# EasyEDA Pro project ProPrj_KrabbyUno - v0.2_2026-05-19.epro, schematic Schematic1

## Sheets
1 P1: Board Name: Board1; Create Date: 2026-01-30; Page Name: P1; Project Name: Patina Foundation Grant; Schematic Name: Schematic1; Update Date: 2026-04-27
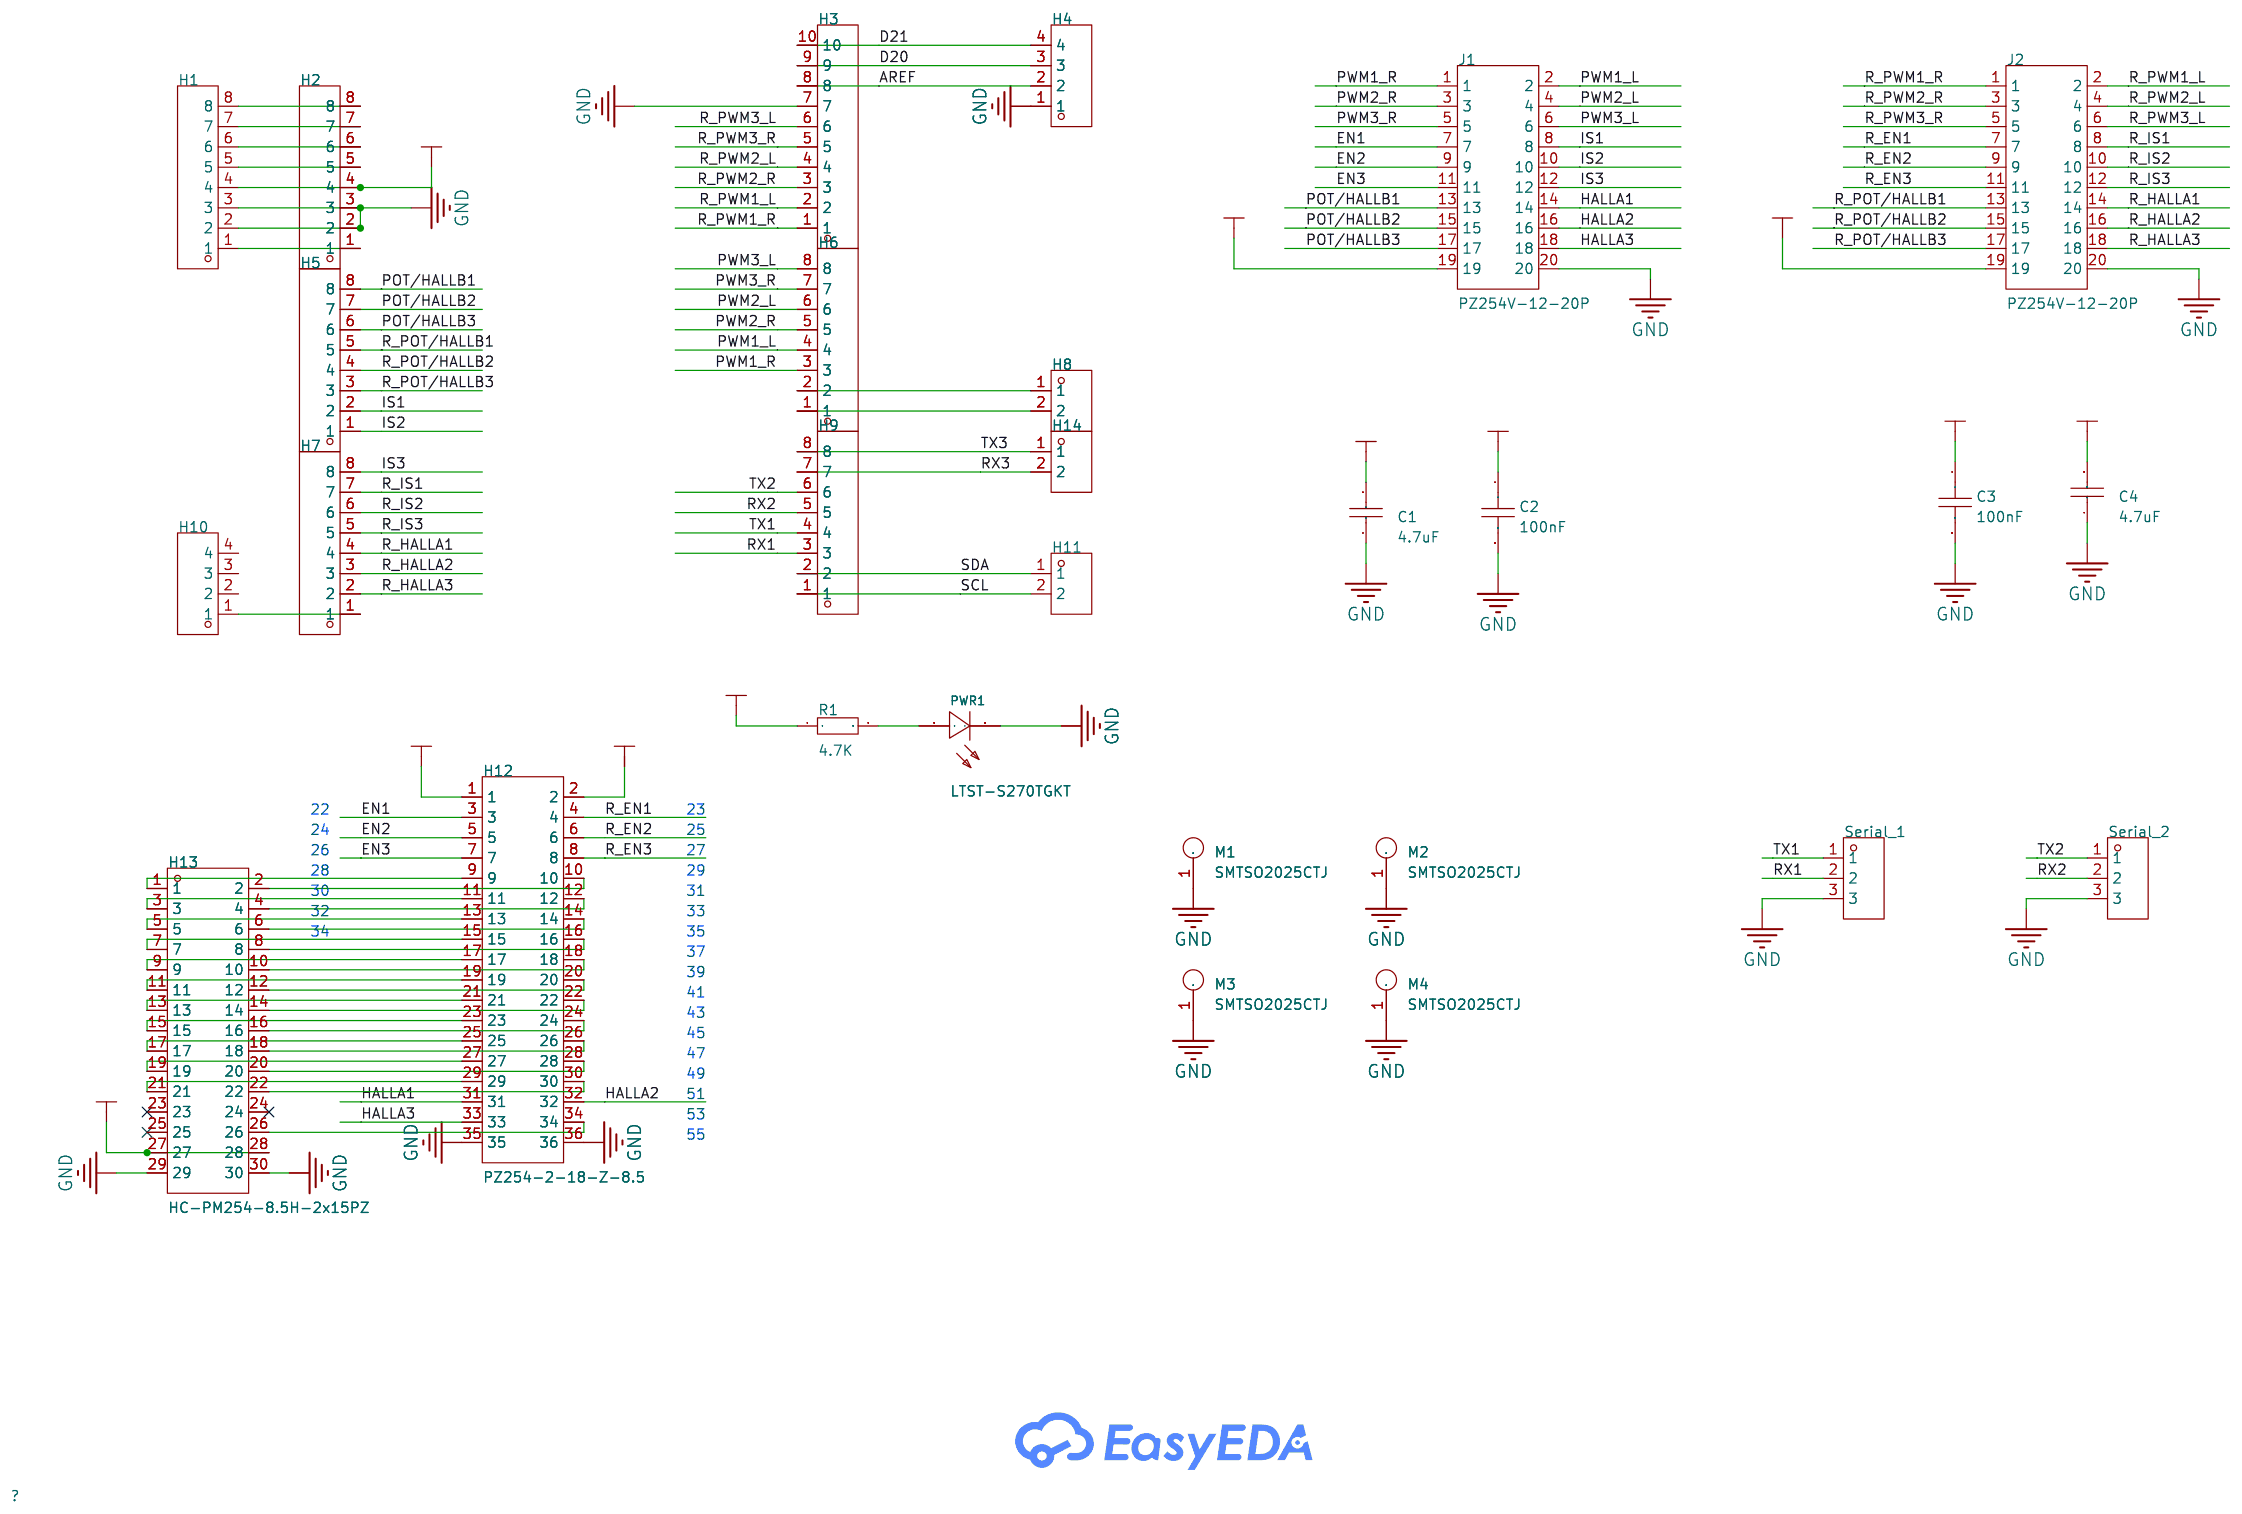
[diagram p0: P1]
2 P2: Create Date: 2026-02-06; Page Name: P2; Update Date: 2026-02-14; Company: EasyEDA.com; Page Size: A4; Version: V1.0
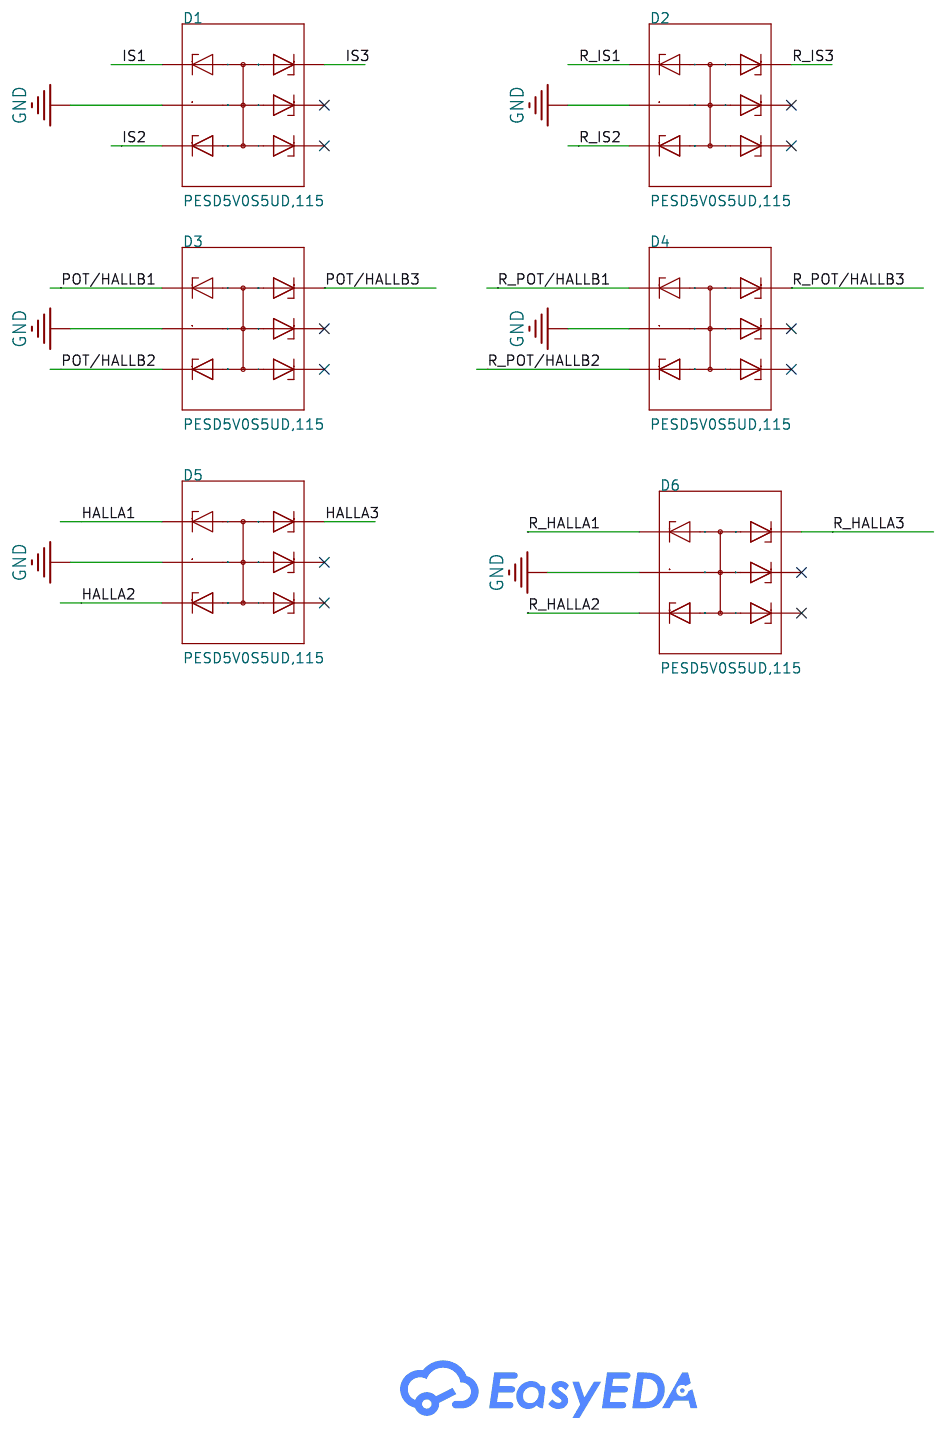
[diagram p1: P2]

## Parts
sheet P1
C1  4.7uF  [C0805]
C2  100nF  [C0603]
C3  100nF  [C0603]
C4  4.7uF  [C0805]
H1  PM254-1-08-Z-8.5  [HDR-TH_8P-P2.54-V-F]
H2  PZ254V-11-08P  [HDR-TH_8P-P2.54-V-M]
H3  PZ254V-11-10P  [HDR-TH_10P-P2.54-V-M]
H4  PM254-1-04-Z-8.5  [HDR-TH_4P-P2.54-V-F]
H5  PZ254V-11-08P  [HDR-TH_8P-P2.54-V-M]
H6  PZ254V-11-08P  [HDR-TH_8P-P2.54-V-M]
H7  PZ254V-11-08P  [HDR-TH_8P-P2.54-V-M]
H8  PM254-1-02-Z-8.5  [HDR-TH_2P-P2.54-V-F]
H9  PZ254V-11-08P  [HDR-TH_8P-P2.54-V-M]
H10  PM254-1-04-Z-8.5  [HDR-TH_4P-P2.54-V-F]
H11  PM254-1-02-Z-8.5  [HDR-TH_2P-P2.54-V-F]
H12  PZ254-2-18-Z-8.5  [HDR-TH_36P-P2.54-V-M-R2-C18-S2.54]
H13  HC-PM254-8.5H-2x15PZ  [HDR-TH_30P-P2.54-V-F-R2-C15-S2.54]
H14  PM254-1-02-Z-8.5  [HDR-TH_2P-P2.54-V-F]
J1  PZ254V-12-20P  [HDR-TH_20P-P2.54-V-M-R2-C10-S2.54]
J2  PZ254V-12-20P  [HDR-TH_20P-P2.54-V-M-R2-C10-S2.54]
M1  SMTSO2025CTJ  [SMD-1_BD6.2-D3.6]  (no BOM)
M2  SMTSO2025CTJ  [SMD-1_BD6.2-D3.6]  (no BOM)
M3  SMTSO2025CTJ  [SMD-1_BD6.2-D3.6]  (no BOM)
M4  SMTSO2025CTJ  [SMD-1_BD6.2-D3.6]  (no BOM)
PWR1  LTST-S270TGKT  [LED-SMD_L1.7-W0.6-RD_GREEN]
R1  4.7K  [R0603]
Serial_1  S03B-XASK-1(LF)(SN)  [CONN-TH_S03B-XASK-1]
Serial_2  S03B-XASK-1(LF)(SN)  [CONN-TH_S03B-XASK-1]
sheet P2
D1  PESD5V0S5UD,115  [SC-74-6_L3.0-W1.5-P0.95-LS2.8-BL]
D2  PESD5V0S5UD,115  [SC-74-6_L3.0-W1.5-P0.95-LS2.8-BL]
D3  PESD5V0S5UD,115  [SC-74-6_L3.0-W1.5-P0.95-LS2.8-BL]
D4  PESD5V0S5UD,115  [SC-74-6_L3.0-W1.5-P0.95-LS2.8-BL]
D5  PESD5V0S5UD,115  [SC-74-6_L3.0-W1.5-P0.95-LS2.8-BL]
D6  PESD5V0S5UD,115  [SC-74-6_L3.0-W1.5-P0.95-LS2.8-BL]

## Library data of the parts
C1 C4 = CL21A475KBQNNNE: Capacitance:4.7uF Tolerance:±10% Tolerance:±10% Voltage Rating:50V Temperature Coefficient:X5R; LCSC Part Name: 4.7uF ±10% 50V; Supplier Part: C98192; Manufacturer: SAMSUNG(三星); Supplier Footprint: 0805; JLCPCB Part Class: Extended Part; Datasheet: https://item.szlcsc.com/datasheet/CL21A475KBQNNNE/99401.html; Supplier: LCSC; Tolerance: ±10%; Voltage Rating: 50V; Temperature Coefficient: X5R
C2 C3 = CAP_0603: Supplier Footprint: 0603
H1 = PM254-1-08-Z-8.5: Holes Structure:1x8P Pitch:2.54mm Row Spacing:- Circular Hole / Square Hole:Square Hole Mounting Type:Through Hole Number of Rows:1 Number of Positions:8P Current Rating:3A Voltage Rating (Max):- Holes Direction:Top Insulation Height:8.5mm Contact Materia; LCSC Part Name: 1x8P 间距:2.54mm 直插; Supplier Part: C2897371; Manufacturer: HCTL(华灿天禄); Supplier Footprint: 插件,P=2.54mm; JLCPCB Part Class: Extended Part; Datasheet: https://item.szlcsc.com/datasheet/PM254-1-08-Z-8.5/3142376.html; Supplier: LCSC; Holes Structure: 1x8P; Pitch: 2.54mm; Circular Hole / Square Hole: Square Hole; Mounting Type: Through Hole; Number of Rows: 1; Number of Positions: 8P; Current Rating: 3A; Holes Direction: Top; Insulation Height: 8.5mm; Contact Material: Copper Alloy; Operating Temperature: -40℃~+105℃
H2 H5-H7 H9 = PZ254V-11-08P: Pin Structure:1x8P Pitch:2.54mm Row Spacing:- Circluar Pins/Square Pins:Pin Header Mounting Type:Through Hole Number of Rows:1 Number of Pins:8P Current Rating:- Voltage Rating (Max):- Length of Mating Pin:6mm Insulation Height:2.5mm Length of End Connect; LCSC Part Name: 1x8P 间距:2.54mm 方针 直插; Supplier Part: C492407; Manufacturer: XFCN(兴飞); Supplier Footprint: 插件,P=2.54mm; JLCPCB Part Class: Extended Part; Datasheet: https://item.szlcsc.com/datasheet/PZ254V-11-08P/502963.html; Supplier: LCSC; Pin Structure: 1x8P; Pitch: 2.54mm; Circluar Pins/Square Pins: Pin Header; Mounting Type: Through Hole; Number of Rows: 1; Number of Pins: 8P; Length of Mating Pin: 6mm; Insulation Height: 2.5mm; Length of End Connection Pin: 3mm; Contact Material: Brass; Operating Temperature: -40℃~+105℃; Color: Black
H3 = PZ254V-11-10P: Pin Structure:1x10P Pitch:2.54mm Row Spacing:- Circluar Pins/Square Pins:Policy Mounting Type:Straight Number of Rows:Single Row Number of Pins:10P Current Rating:- Voltage Rating (Max):- Length of Mating Pin:6mm Insulation Height:2.5mm Length of End Conn; LCSC Part Name: 1x10P 间距:2.54mm 方针 直插; Supplier Part: C492409; Manufacturer: XFCN(兴飞); Supplier Footprint: 插件,P=2.54mm; JLCPCB Part Class: Extended Part; Datasheet: https://atta.szlcsc.com/upload/public/pdf/source/20200309/C492409_129C9431BDD62EBBBD0A643B6AAB9FBD.pdf; Supplier: LCSC; Pin Structure: 1x10P; Pitch: 2.54mm; Circluar Pins/Square Pins: Policy; Mounting Type: Straight; Number of Rows: Single Row; Number of Pins: 10P; Length of Mating Pin: 6mm; Insulation Height: 2.5mm; Length of End Connection Pin: 3mm; Contact Material: Brass; Operating Temperature: -40℃~+105℃; Color: Black
H4 H10 = PM254-1-04-Z-8.5: Holes Structure:1x4P Pitch:2.54mm Row Spacing:- Circular Hole / Square Hole:Square Hole Mounting Type:Through Hole Number of Rows:1 Number of Positions:4P Current Rating:3A Holes Direction:Top Insulation Height:8.5mm Contact Material:Copper Alloy Operatin; LCSC Part Name: 1x4P 间距:2.54mm 直插; Supplier Part: C3012026; Manufacturer: HCTL(华灿天禄); Supplier Footprint: 插件,P=2.54mm; JLCPCB Part Class: Extended Part; Datasheet: https://item.szlcsc.com/datasheet/PM254-1-04-Z-8.5/3516547.html; Supplier: LCSC; Holes Structure: 1x4P; Pitch: 2.54mm; Circular Hole / Square Hole: Square Hole; Mounting Type: Through Hole; Number of Rows: 1; Number of Positions: 4P; Current Rating: 3A; Holes Direction: Top; Insulation Height: 8.5mm; Contact Material: Copper Alloy; Operating Temperature: -40℃~+105℃
H8 H11 H14 = PM254-1-02-Z-8.5: Holes Structure:1x2P Pitch:2.54mm Row Spacing:- Circular Hole / Square Hole:Square Hole Mounting Type:Through Hole Number of Rows:1 Number of Positions:2P Current Rating:3A Voltage Rating (Max):- Holes Direction:Top Insulation Height:8.5mm Contact Materia; LCSC Part Name: 1x2P 间距:2.54mm 直插; Supplier Part: C2897365; Manufacturer: HCTL(华灿天禄); Supplier Footprint: 插件,P=2.54mm; JLCPCB Part Class: Extended Part; Datasheet: https://item.szlcsc.com/datasheet/PM254-1-02-Z-8.5/3142370.html; Supplier: LCSC; Holes Structure: 1x2P; Pitch: 2.54mm; Circular Hole / Square Hole: Square Hole; Mounting Type: Through Hole; Number of Rows: 1; Number of Positions: 2P; Current Rating: 3A; Holes Direction: Top; Insulation Height: 8.5mm; Contact Material: Copper Alloy; Operating Temperature: -40℃~+105℃
H12 = PZ254-2-18-Z-8.5: Pin Structure:2x18P Pitch:2.54mm Circluar Pins/Square Pins:Pin Header Mounting Type:Through Hole Number of Rows:2 Number of Pins:36P Current Rating:3A Voltage Rating (Max):- Length of Mating Pin:6mm Insulation Height:2.5mm Length of End Connection Pin:3mm; LCSC Part Name: 2x18P 间距:2.54mm 方针 直插; Supplier Part: C3012258; Manufacturer: HCTL(华灿天禄); Supplier Footprint: 插件,P=2.54mm; JLCPCB Part Class: Extended Part; Datasheet: https://item.szlcsc.com/datasheet/PZ254-2-18-Z-8.5/3516729.html; Supplier: LCSC; Pin Structure: 2x18P; Pitch: 2.54mm; Circluar Pins/Square Pins: Pin Header; Mounting Type: Through Hole; Number of Rows: 2; Number of Pins: 36P; Current Rating: 3A; Length of Mating Pin: 6mm; Insulation Height: 2.5mm; Length of End Connection Pin: 3mm; Contact Material: Brass; Operating Temperature: -40℃~+105℃; Color: Black
H13 = HC-PM254-8.5H-2x15PZ: Holes Structure:2x15P Pitch:2.54mm Row Spacing:2.54mm Circular Hole / Square Hole:Square Hole Mounting Type:Through Hole Number of Rows:2 Number of Positions:30P Current Rating:3A Voltage Rating (Max):- Holes Direction:Top Insulation Height:8.5mm Contact; LCSC Part Name: 间距2.54mm 2x15Pin 直插 PC3.0 H8.5; Supplier Part: C22373920; Manufacturer: HC(虹成电子); Supplier Footprint: 插件,P=2.54mm; JLCPCB Part Class: Extended Part; Datasheet: https://item.szlcsc.com/datasheet/HC-PM254-8.5H-2x15PZ/23870256.html; Supplier: LCSC; Holes Structure: 2x15P; Pitch: 2.54mm; Row Spacing: 2.54mm; Circular Hole / Square Hole: Square Hole; Mounting Type: Through Hole; Number of Rows: 2; Number of Positions: 30P; Current Rating: 3A; Holes Direction: Top; Insulation Height: 8.5mm; Contact Material: Brass; Contact Plating: Gold; Operating Temperature: -40℃~+105℃; PIN Length: 3mm
J1 J2 = PZ254V-12-20P: Pin Structure:2x10P Pitch:2.54mm Row Spacing:2.54mm Circluar Pins/Square Pins:Pin Header Mounting Type:Through Hole Number of Rows:2 Number of Pins:20P Current Rating:- Voltage Rating (Max):- Length of Mating Pin:6mm Insulation Height:2.5mm Length of End; LCSC Part Name: 2x10P 间距:2.54mm 方针 直插; Supplier Part: C492427; Manufacturer: XFCN(兴飞); Supplier Footprint: 插件,P=2.54mm; JLCPCB Part Class: Extended Part; Datasheet: https://item.szlcsc.com/datasheet/PZ254V-12-20P/502983.html; Supplier: LCSC; Pin Structure: 2x10P; Pitch: 2.54mm; Row Spacing: 2.54mm; Circluar Pins/Square Pins: Pin Header; Mounting Type: Through Hole; Number of Rows: 2; Number of Pins: 20P; Length of Mating Pin: 6mm; Insulation Height: 2.5mm; Length of End Connection Pin: 3mm; Contact Material: Brass; Operating Temperature: -40℃~+105℃; Color: Black
M1-M4 = SMTSO2025CTJ: specifications:M2X2.5 surface treatment:镀锡 Product Description:- material quality:-; LCSC Part Name: 雄和远景，电路板表贴圆螺母柱，M2X2.5，铜镀锡,1个; Supplier Part: C2916321; Manufacturer: Sinhoo(雄和远景); JLCPCB Part Class: Extended Part; Datasheet: https://atta.szlcsc.com/upload/public/pdf/source/20211122/17CF5E24EB4D4DC090A80DE3D7DE5E21.pdf; Supplier: LCSC; specifications: M2X2.5; surface treatment: 镀锡
PWR1 = LTST-S270TGKT: Illumination Color:Yellow Green Voltage - Forward(Vf):3.2V Voltage - Forward(Vf):3.2V Power(Watts):76mW Forward Current:20mA Wavelength - Dominant:525nm Wavelength - Dominant:525nm Peak Wavelength:530nm Diode Configuration:- Lens Color:Water Clear Color T; LCSC Part Name: 普绿/黄绿 侧贴; Supplier Part: C364567; Manufacturer: LITEON(光宝); Supplier Footprint: SMD,1.2x1.6mm; JLCPCB Part Class: Extended Part; Datasheet: https://item.szlcsc.com/datasheet/LTST-S270TGKT/338897.html; Supplier: LCSC; Illumination Color: Yellow Green; Voltage - Forward(Vf): 3.2V; Power(Watts): 76mW; Forward Current: 20mA; Wavelength - Dominant: 525nm; Peak Wavelength: 530nm; Lens Color: Water Clear; Luminous Intensity: 450mcd; Viewing Angle: 130°; Mounting Style: Side View Mount; Operating Temperature: -20℃~+80℃
R1 = Res_0603: Supplier Footprint: 0603
Serial_1 Serial_2 = S03B-XASK-1(LF)(SN): Pins Structure:1x3P Pitch:2.5mm Mounting Style:Bend insert Reference Series:XA Number of Pins:3P Number of Rows:1 Number of PINs Per Row:3 Row Spacing:- Current Rating (Max):3A Contact Material:Copper alloy Contact Plating:Tin Operating Temperature Range:; LCSC Part Name: 1x3P 间距:2.5mm 弯插 系列:XA; Supplier Part: C491707; Manufacturer: JST; Supplier Footprint: 弯插,P=2.5mm; JLCPCB Part Class: Extended Part; Datasheet: https://atta.szlcsc.com/upload/public/pdf/source/20220509/C25BFBA8A7816C529B22589B590C7AEA.pdf; Supplier: LCSC; Pins Structure: 1x3P; Pitch: 2.5mm; Mounting Style: Bend insert; Reference Series: XA; Number of Pins: 3P; Number of Rows: 1; Number of PINs Per Row: 3; Current Rating (Max): 3A; Contact Material: Copper alloy; Contact Plating: Tin; Operating Temperature Range: -25℃~+85℃; Rated Voltage (Max): 250V; Plastic Material: Glass Fiber Reinforced PA66; Flame Retardant Rating: UL94V-0; Supplementary Features: Fishhook Foot (Plastic)；K-leg punch; Colour: White; Z-Height of the Board: 7.6mm; X-Length of Bottom Edge on Board (Spacing Line): 10mm; Y-Width of Bottom Edge on Board: 12.6mm
D1-D6 = PESD5V0S5UD,115: Polarity:Bidirectional Reverse Stand-Off Voltage (Vrwm):5V Clamping Voltage:13V Peak Pulse Current (Ipp):20A@8/20us Peak Pulse Power Dissipation (Ppp):200W@8/20us Voltage - Breakdown:6.8V Reverse Leakage Current (Ir):200nA Number of Channels:5 Operating T; LCSC Part Name: 双向ESD 5V截止 峰值脉冲电流：20A@8/20us; Supplier Part: C122564; Manufacturer: Nexperia(安世); Supplier Footprint: SC-74; JLCPCB Part Class: Extended Part; Datasheet: https://item.szlcsc.com/datasheet/PESD5V0S5UD%252C115/123833.html; Supplier: LCSC; Polarity: Bidirectional; Reverse Stand-Off Voltage (Vrwm): 5V; Clamping Voltage: 13V; Peak Pulse Current (Ipp): 20A@8/20us; Peak Pulse Power Dissipation (Ppp): 200W@8/20us; Voltage - Breakdown: 6.8V; Reverse Leakage Current (Ir): 200nA; Number of Channels: 5; Operating Temperature: -65℃~+150℃@(Ta); level of protection: IEC 61000-4-2; Type: ESD; Junction Capacitance: 165pF

## Nets
+5V: C1.2 C2.1 C3.1 C4.2 H1.4 H2.4 H12.1 H12.2 H13.27 H13.28 J1.19 J2.19 R1.1
GND: C1.1 C2.2 C3.2 C4.1 D1.2 D2.2 D3.2 D4.2 D5.2 D6.2 H1.2 H1.3 H2.2 H2.3 H3.7 H4.1 H12.35 H12.36 H13.29 H13.30 J1.20 J2.20 M1.1 M2.1 M3.1 M4.1 PWR1.1(-) Serial_1.3 Serial_2.3
AREF: H3.8 H4.2
D20: H3.9 H4.3
D21: H3.10 H4.4
EN1: H12.3 J1.7
EN2: H12.5 J1.9
EN3: H12.7 J1.11
HALLA1: D5.1 H12.31 J1.14
HALLA2: D5.3 H12.32 J1.16
HALLA3: D5.6 H12.33 J1.18
IS1: D1.1 H5.2 J1.8
IS2: D1.3 H5.1 J1.10
IS3: D1.6 H7.8 J1.12
POT/HALLB1: D3.1 H5.8 J1.13
POT/HALLB2: D3.3 H5.7 J1.15
POT/HALLB3: D3.6 H5.6 J1.17
PWM1_L: H6.4 J1.2
PWM1_R: H6.3 J1.1
PWM2_L: H6.6 J1.4
PWM2_R: H6.5 J1.3
PWM3_L: H6.8 J1.6
PWM3_R: H6.7 J1.5
R_EN1: H12.4 J2.7
R_EN2: H12.6 J2.9
R_EN3: H12.8 J2.11
R_HALLA1: D6.1 H7.4 J2.14
R_HALLA2: D6.3 H7.3 J2.16
R_HALLA3: D6.6 H7.2 J2.18
R_IS1: D2.1 H7.7 J2.8
R_IS2: D2.3 H7.6 J2.10
R_IS3: D2.6 H7.5 J2.12
R_POT/HALLB1: D4.1 H5.5 J2.13
R_POT/HALLB2: D4.3 H5.4 J2.15
R_POT/HALLB3: D4.6 H5.3 J2.17
R_PWM1_L: H3.2 J2.2
R_PWM1_R: H3.1 J2.1
R_PWM2_L: H3.4 J2.4
R_PWM2_R: H3.3 J2.3
R_PWM3_L: H3.6 J2.6
R_PWM3_R: H3.5 J2.5
RX1: H9.3 Serial_1.2
RX2: H9.5 Serial_2.2
RX3: H9.7 H14.2
SCL: H9.1 H11.2
SDA: H9.2 H11.1
TX1: H9.4 Serial_1.1
TX2: H9.6 Serial_2.1
TX3: H9.8 H14.1
$1N20121: PWR1.2(+) R1.2
$1N20679: H6.1 H8.2
$1N20691: H6.2 H8.1
$1N21733: H7.1 H10.1
$1N21820: H1.5 H2.5
$1N21825: H1.8 H2.8
$1N21830: H1.7 H2.7
$1N21836: H1.6 H2.6
$1N23731: H1.1 H2.1
$1N24030: H12.17 H13.9
$1N24036: H12.18 H13.10
$1N24042: H12.19 H13.11
$1N24048: H12.20 H13.12
$1N24054: H12.21 H13.13
$1N24060: H12.22 H13.14
$1N24066: H12.23 H13.15
$1N24072: H12.24 H13.16
$1N24078: H12.25 H13.17
$1N24084: H12.26 H13.18
$1N24090: H12.27 H13.19
$1N24096: H12.28 H13.20
$1N24102: H12.29 H13.21
$1N24108: H12.30 H13.22
$1N38352: H12.9 H13.1
$1N38357: H12.11 H13.3
$1N38366: H12.13 H13.5
$1N38371: H12.15 H13.7
$1N38377: H12.16 H13.8
$1N38430: H12.34 H13.26
$1N38639: H12.10 H13.2
$1N38644: H12.12 H13.4
$1N38650: H12.14 H13.6

Not connected (* = marked no-connect by the designer): D1 4* 5*; D2 4* 5*; D3 4* 5*; D4 4* 5*; D5 4* 5*; D6 4* 5*; H10 2 3 4; H13 23* 24* 25*

## Notes on the sheets
sheet 1
- 22
- 23
- 24
- 25
- 26
- 27
- 28
- 30
- 29
- 31
- 32
- 33
- 34
- 35
- 37
- 39
- 41
- 43
- 45
- 47
- 49
- 51
- 53
- 55
